# Altium project GSM_Link_12.PrjPcb
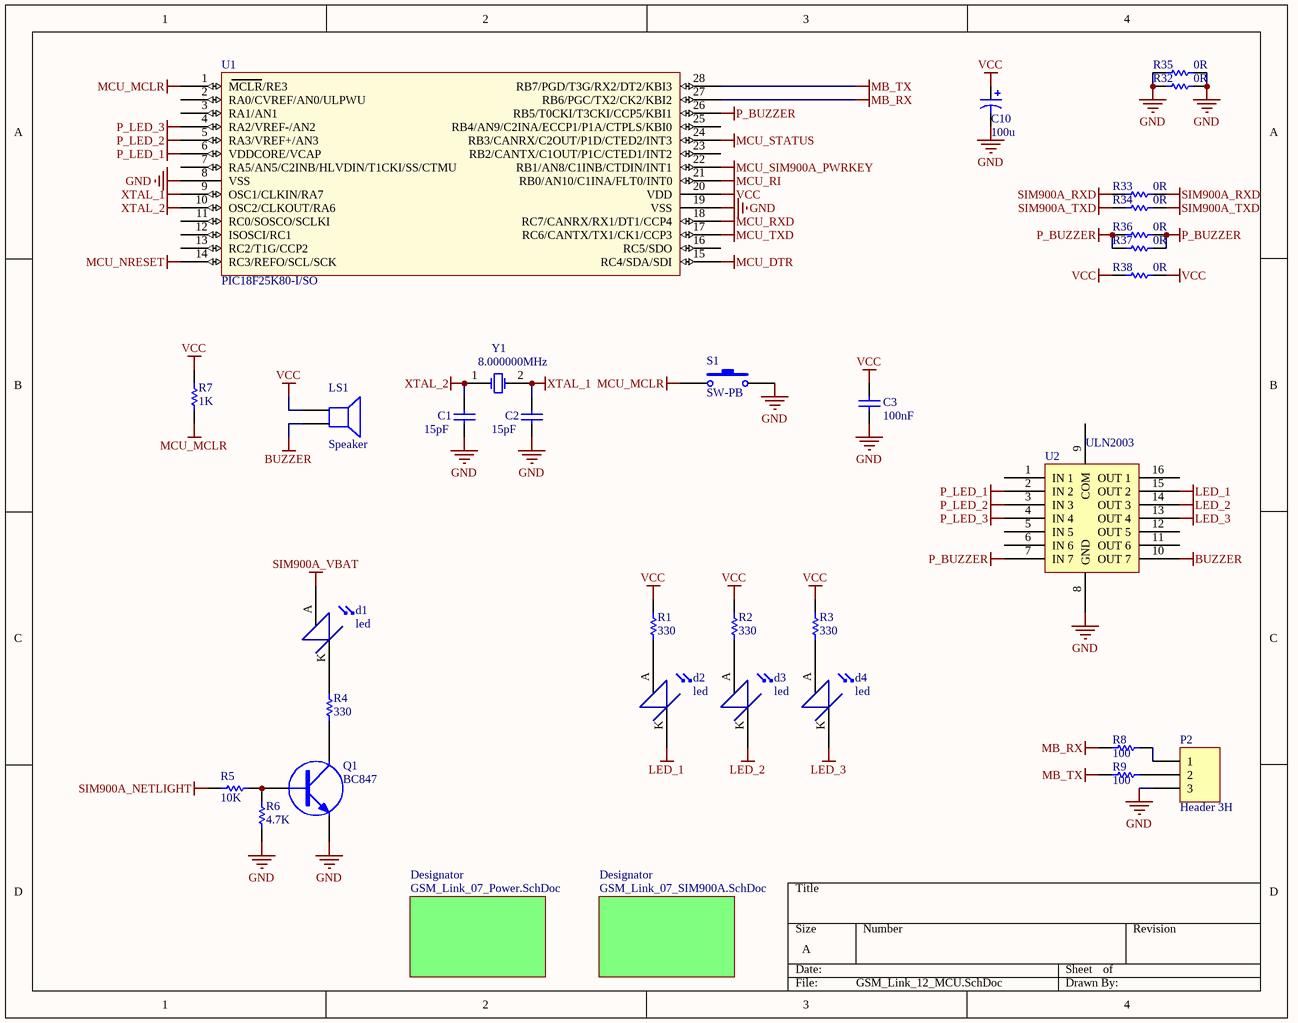
[diagram p0: GSM_Link_12_MCU.SchDoc]
3 sheets, 85 parts. Net scope: global (net labels, ports and power ports of the same name join across sheets).
Board file: GSM_Link_12.PcbDoc
Sheets:
  GSM_Link_12_MCU.SchDoc
  GSM_Link_12_Power.SchDoc
  GSM_Link_12_SIM900A.SchDoc

## Sheet GSM_Link_12_MCU.SchDoc
size A

### Parts
C1  15pF  [0805_smd]
C2  15pF  [0805_smd]
C3  100nF  [0805_smd]
C10  100u  [RB.1/.2_P]
d1  led  [0603_LED_SMD]
d2  led  [0603_LED_SMD]
d3  led  [0603_LED_SMD]
d4  led  [0603_LED_SMD]
LS1  Speaker  [BZ_KD]
P2  Header 3H  [CON3_XH]
Q1  BC847  [SOT23_SMD]
R1  330  [0805_SMD]
R2  330  [0805_SMD]
R3  330  [0805_SMD]
R4  330  [0805_SMD]
R5  10K  [0805_SMD]
R6  4.7K  [0805_SMD]
R7  1K  [1206_SMD]
R8  100  [0805_SMD]
R9  100  [0805_SMD]
R32  0R  [1206_SMD]
R33  0R  [1206_SMD]
R34  0R  [1206_SMD]
R35  0R  [1206_SMD]
R36  0R  [1206_SMD]
R37  0R  [2010_SMD]
R38  0R  [1206_SMD]
S1  SW-PB  [switch3_smd]
U1  PIC18F25K80-I/SO  [SOIC28_SMD]
U2  ULN2003  [SO-16_smd]
Y1  8.000000MHz  [rad-0.2]

### Sub-sheets
Designator = GSM_Link_07_SIM900A.SchDoc (file not in this document): no entries
Designator = GSM_Link_07_Power.SchDoc (file not in this document): no entries

### Nets
BUZZER: LS1.2 U2.10(OUT_7)
GND: C1.1 C2.1 C3.1 C10.2 P2.3 Q1.2(E) R6.1 R32.1 R32.2 R35.1 R35.2 S1.2 U1.8(VSS) U1.19(VSS) U2.8(GND)
LED_1: d2.K U2.15(OUT_2)
LED_2: d3.K U2.14(OUT_3)
LED_3: d4.K U2.13(OUT_4)
MB_RX: R8.1 U1.27(RB6/PGC/TX2/CK2/KBI2)
MB_TX: R9.1 U1.28(RB7/PGD/T3G/RX2/DT2/KBI3)
MCU_DTR: U1.15(RC4/SDA/SDI)
MCU_MCLR: R7.2 S1.1 U1.1(MCLR/RE3)
MCU_NRESET: U1.14(RC3/REFO/SCL/SCK)
MCU_RI: U1.21(RB0/AN10/C1INA/FLT0/INT0)
MCU_RXD: U1.18(RC7/CANRX/RX1/DT1/CCP4)
MCU_SIM900A_PWRKEY: U1.22(RB1/AN8/C1INB/CTDIN/INT1)
MCU_STATUS: U1.24(RB3/CANRX/C2OUT/P1D/CTED2/INT3)
MCU_TXD: U1.17(RC6/CANTX/TX1/CK1/CCP3)
P_BUZZER: R36.1 R36.2 R37.1 R37.2 U1.26(RB5/T0CKI/T3CKI/CCP5/KBI1) U2.7(IN_7)
P_LED_1: U1.6(VDDCORE/VCAP) U2.2(IN_2)
P_LED_2: U1.5(RA3/VREF+/AN3) U2.3(IN_3)
P_LED_3: U1.4(RA2/VREF-/AN2) U2.4(IN_4)
SIM900A_NETLIGHT: R5.2
SIM900A_RXD: R33.1 R33.2
SIM900A_TXD: R34.1 R34.2
SIM900A_VBAT: d1.A
VCC: C3.2 C10.1 LS1.1 R1.1 R2.1 R3.1 R7.1 R38.1 R38.2 U1.20(VDD)  [project net MCU_VCC]
XTAL_1: C2.2 U1.9(OSC1/CLKIN/RA7) Y1.2(OSC2)
XTAL_2: C1.2 U1.10(OSC2/CLKOUT/RA6) Y1.1(OSC1)
Netd1_K: d1.K R4.1
Netd2_A: d2.A R1.2
Netd3_A: d3.A R2.2
Netd4_A: d4.A R3.2
NetP2_1: P2.1 R8.2
NetP2_2: P2.2 R9.2
NetQ1_1: Q1.1(B) R5.1 R6.2
NetQ1_3: Q1.3(C) R4.2

Not connected (* = marked no-connect by the designer): U1 2(RA0/CVREF/AN0/ULPWU) 3(RA1/AN1) 7(RA5/AN5/C2INB/HLVDIN/T1CKI/SS/CTMU) 11(RC0/SOSCO/SCLKI) 12(ISOSCI/RC1) 13(RC2/T1G/CCP2) 16(RC5/SDO) 23(RB2/CANTX/C1OUT/P1C/CTED1/INT2) 25(RB4/AN9/C2INA/ECCP1/P1A/CTPLS/KBI0); U2 1(IN_1) 5(IN_5) 6(IN_6) 9(COM) 11(OUT_6) 12(OUT_5) 16(OUT_1)

### Library data of the parts
C1-C3 = Cap: Capacitor; Value: 100pF; Published: 8-Jun-2000; LatestRevisionDate: 17-Jul-2002; LatestRevisionNote: Re-released for DXP Platform.; PackageReference: RAD-0.3; Publisher: Altium Limited
C10 = Cap Pol1: Polarized Capacitor (Radial); Value: 100nF; Published: 8-Jun-2000; LatestRevisionDate: 17-Jul-2002; LatestRevisionNote: Re-released for DXP Platform.; PackageReference: RB7.6-15; Publisher: Altium Limited
LS1 = Speaker: Loudspeaker; Published: 24-Mar-1999; LatestRevisionDate: 17-Jul-2002; LatestRevisionNote: Re-released for DXP Platform.; PackageReference: PIN2; Publisher: Altium Limited
P2 = Header 3H: Header, 3-Pin, Right Angle; LatestRevisionDate: 17-Jul-2002; LatestRevisionNote: Re-released for DXP Platform.; Publisher: Altium Limited
Q1 = BC547
R1-R9 = Res1: Resistor; Published: 8-Jun-2000; LatestRevisionDate: 17-Jul-2002; LatestRevisionNote: Re-released for DXP Platform.; PackageReference: AXIAL-0.3; Publisher: Altium Limited
  R1-R4: Value: 330
  R5: Value: 10k
  R6: Value: 4.7k
  R7: Value: 1K
  R8 R9: Value: 100
R32-R38 = Res1: Resistor; Value: 0; Published: 8-Jun-2000; LatestRevisionDate: 17-Jul-2002; LatestRevisionNote: Re-released for DXP Platform.; PackageReference: AXIAL-0.3; Publisher: Altium Limited
S1 = SW-PB: Switch; Published: 24-Mar-1999; LatestRevisionDate: 17-Jul-2002; LatestRevisionNote: Re-released for DXP Platform.; PackageReference: SPST-2; Publisher: Altium Limited
Y1 = XTAL: Crystal Oscillator; Published: 8-Jun-2000; LatestRevisionDate: 17-Jul-2002; LatestRevisionNote: Re-released for DXP Platform.; PackageReference: R38; Publisher: Altium Limited

## Sheet GSM_Link_12_Power.SchDoc
size A
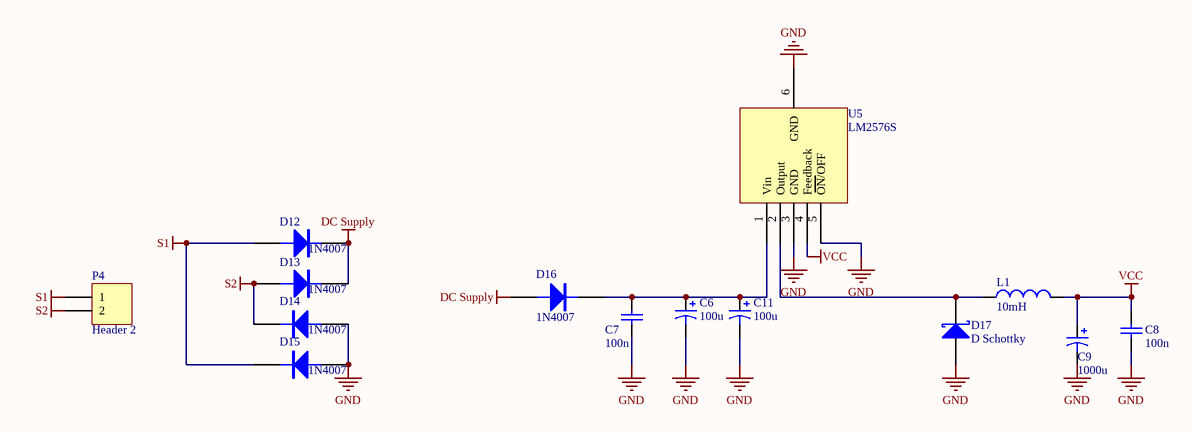
[diagram p1: GSM_Link_12_Power.SchDoc]

### Parts
C6  100u  [RB.2/.4_p]
C7  100n  [0805_smd]
C8  100n  [0805_smd]
C9  1000u  [RB.2/.4_p]
C11  100u  [RB.1/.2_P]
D12  1N4007  [7227_SMD]
D13  1N4007  [7227_SMD]
D14  1N4007  [7227_SMD]
D15  1N4007  [7227_SMD]
D16  1N4007  [7227_SMD]
D17  D Schottky  [7227_SMD]
L1  10mH  [RB.2/.4]
P4  Header 2  [PCON_2]
U5  LM2576S  [D2PAK_SMD]

### Nets
DC Supply: D12.K D13.K D16.A
GND: C6.2 C7.1 C8.1 C9.2 C11.2 D14.A D15.A D17.A U5.3(GND) U5.5(ON/OFF) U5.6(GND)
S1: D12.A D15.K P4.1
S2: D13.A D14.K P4.2
VCC: C8.2 C9.1 L1.2 U5.4(Feedback)  [project net MCU_VCC]
NetC6_1: C6.1 C7.2 C11.1 D16.K U5.1(Vin)
NetD17_K: D17.K L1.1 U5.2(Output)

### Library data of the parts
C6 C9 C11 = Cap Pol1: as C10 on sheet GSM_Link_12_MCU; Published: 8-Jun-2000; LatestRevisionDate: 17-Jul-2002; LatestRevisionNote: Re-released for DXP Platform.; PackageReference: RB7.6-15; Publisher: Altium Limited
C7 C8 = Cap: Capacitor; Value: 100u; Published: 8-Jun-2000; LatestRevisionDate: 17-Jul-2002; LatestRevisionNote: Re-released for DXP Platform.; PackageReference: RAD-0.3; Publisher: Altium Limited
D12-D16 = DIODE
D17 = D Schottky: Schottky Diode; Published: 8-Jun-2000; LatestRevisionDate: 17-Jul-2002; LatestRevisionNote: Re-released for DXP Platform.; PackageReference: SMB; Publisher: Altium Limited; Code_JEDEC: DO-214-AA
L1 = Inductor: Code_IEC: 1005; Published: 8-Jun-2000; LatestRevisionDate: 17-Jul-2002; LatestRevisionNote: Re-released for DXP Platform.; PackageReference: 0402-A; Publisher: Altium Limited; Code_JEITA: 0402; Value: 10mH
P4 = Header 2: Header, 2-Pin; LatestRevisionDate: 17-Jul-2002; LatestRevisionNote: Re-released for DXP Platform.; Publisher: Altium Limited

## Sheet GSM_Link_12_SIM900A.SchDoc
size A
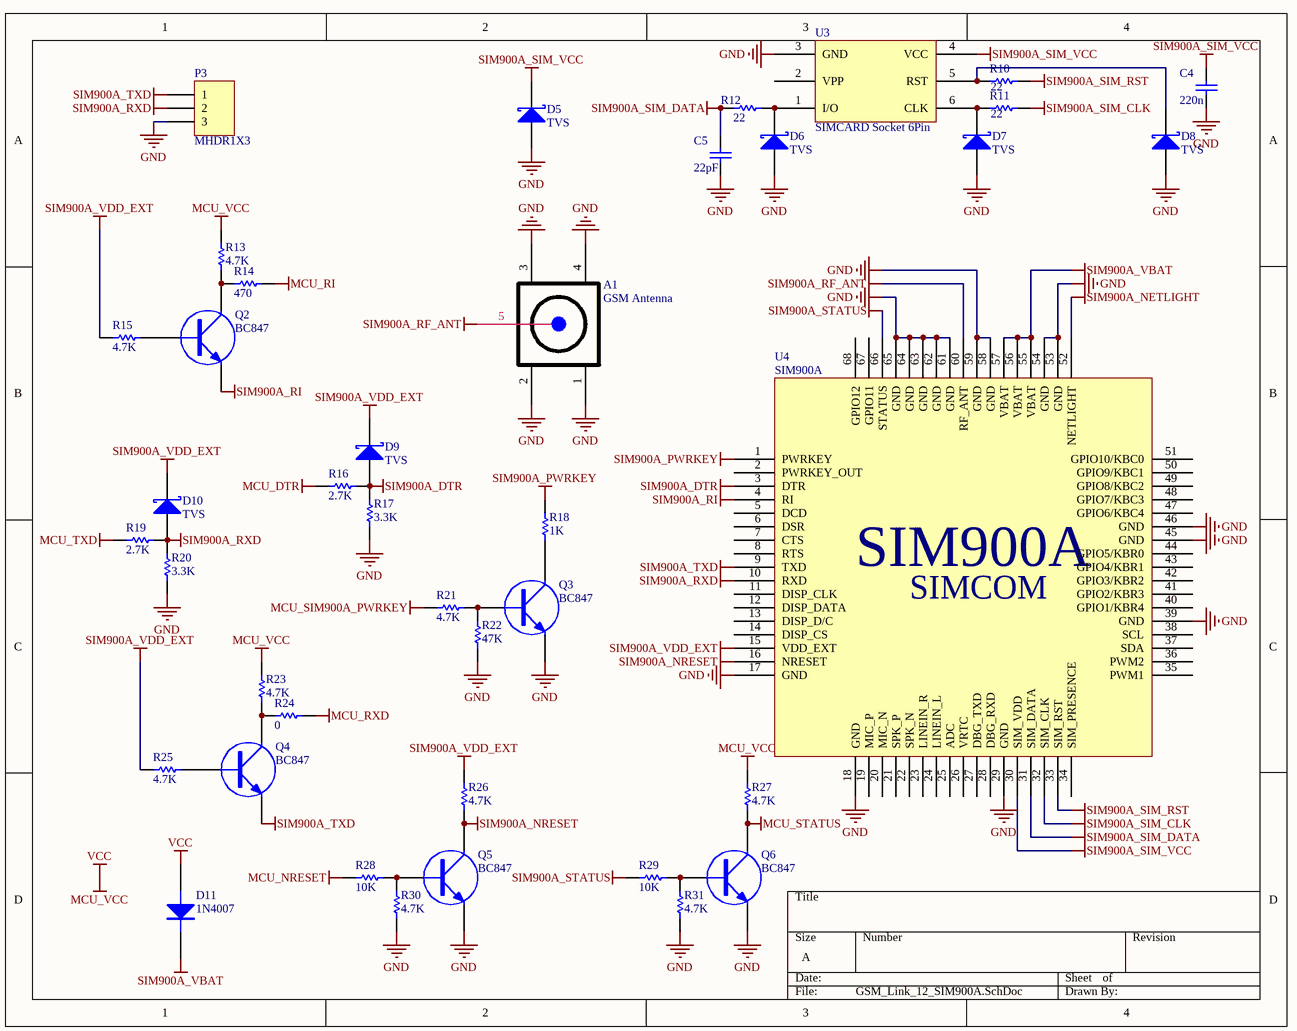
[diagram p2: GSM_Link_12_SIM900A.SchDoc]

### Parts
A1  GSM Antenna  [SMA Right Female]
C4  220n  [0805_smd]
C5  22pF  [0805_smd]
D5  TVS  [7227_SMD]
D6  TVS  [7227_SMD]
D7  TVS  [7227_SMD]
D8  TVS  [7227_SMD]
D9  TVS  [7227_SMD]
D10  TVS  [7227_SMD]
D11  1N4007  [7227_SMD]
P3  MHDR1X3  [CON3_XH]
Q2  BC847  [SOT23_SMD]
Q3  BC847  [SOT23_SMD]
Q4  BC847  [SOT23_SMD]
Q5  BC847  [SOT23_SMD]
Q6  BC847  [SOT23_SMD]
R10  22  [0805_SMD]
R11  22  [0805_SMD]
R12  22  [1206_SMD]
R13  4.7K  [0805_SMD]
R14  470  [1206_SMD]
R15  4.7K  [0805_SMD]
R16  2.7K  [1206_SMD]
R17  3.3K  [0805_SMD]
R18  1K  [0805_SMD]
R19  2.7K  [1206_SMD]
R20  3.3K  [1206_SMD]
R21  4.7K  [0805_SMD]
R22  47K  [0805_SMD]
R23  4.7K  [1206_SMD]
R24  0  [1206_SMD]
R25  4.7K  [0805_SMD]
R26  4.7K  [0805_SMD]
R27  4.7K  [0805_SMD]
R28  10K  [1206_SMD]
R29  10K  [0805_SMD]
R30  4.7K  [0805_SMD]
R31  4.7K  [0805_SMD]
U3  SIMCARD Socket 6Pin  [SIMCARD Socket - Ejector]
U4  SIM900A  [SIM900A]

### Nets
GND: A1.1 A1.2 A1.3 A1.4 C4.1 C5.1 D5.A D6.A D7.A D8.A P3.3 Q3.2(E) Q5.2(E) Q6.2(E) R17.1 R20.1 R22.2 R30.1 R31.1 U3.3(GND) U4.17(GND) U4.18(GND) U4.29(GND) U4.39(GND) U4.45(GND) U4.46(GND) U4.53(GND) U4.54(GND) U4.58(GND) U4.59(GND) U4.61(GND) U4.62(GND) U4.63(GND) U4.64(GND) U4.65(GND)
MCU_DTR: R16.2
MCU_NRESET: R28.1
MCU_RI: R14.2
MCU_RXD: R24.2
MCU_SIM900A_PWRKEY: R21.1
MCU_STATUS: Q6.3(C) R27.2
MCU_TXD: R19.2
MCU_VCC: D11.A R13.2 R23.2 R27.1  [also labelled VCC]
SIM900A_DTR: D9.A R16.1 R17.2 U4.3(DTR)
SIM900A_NETLIGHT: U4.52(NETLIGHT)
SIM900A_NRESET: Q5.3(C) R26.1 U4.16(NRESET)
SIM900A_PWRKEY: R18.2 U4.1(PWRKEY)
SIM900A_RF_ANT: A1.5 U4.60(RF_ANT)
SIM900A_RI: Q2.2(E) U4.4(RI)
SIM900A_RXD: D10.A P3.2 R19.1 R20.2 U4.10(RXD)
SIM900A_SIM_CLK: R11.2 U4.32(SIM_CLK)
SIM900A_SIM_DATA: C5.2 R12.2 U4.31(SIM_DATA)
SIM900A_SIM_RST: R10.2 U4.33(SIM_RST)
SIM900A_SIM_VCC: C4.2 D5.K U3.4(VCC) U4.30(SIM_VDD)
SIM900A_STATUS: R29.2 U4.66(STATUS)
SIM900A_TXD: P3.1 Q4.2(E) U4.9(TXD)
SIM900A_VBAT: D11.K U4.55(VBAT) U4.56(VBAT) U4.57(VBAT)
SIM900A_VDD_EXT: D9.K D10.K R15.1 R25.1 R26.2 U4.15(VDD_EXT)
NetD6_K: D6.K R12.1 U3.1(I/O)
NetD7_K: D7.K R11.1 U3.6(CLK)
NetD8_K: D8.K R10.1 U3.5(RST)
NetQ2_1: Q2.1(B) R15.2
NetQ2_3: Q2.3(C) R13.1 R14.1
NetQ3_1: Q3.1(B) R21.2 R22.1
NetQ3_3: Q3.3(C) R18.1
NetQ4_1: Q4.1(B) R25.2
NetQ4_3: Q4.3(C) R23.1 R24.1
NetQ5_1: Q5.1(B) R28.2 R30.2
NetQ6_1: Q6.1(B) R29.1 R31.2

Not connected (* = marked no-connect by the designer): U3 2(VPP); U4 2(PWRKEY_OUT) 5(DCD) 6(DSR) 7(CTS) 8(RTS) 11(DISP_CLK) 12(DISP_DATA) 13(DISP_D/C) 14(DISP_CS) 19(MIC_P) 20(MIC_N) 21(SPK_P) 22(SPK_N) 23(LINEIN_R) 24(LINEIN_L) 25(ADC) 26(VRTC) 27(DBG_TXD) 28(DBG_RXD) 34(SIM_PRESENCE) 35(PWM1) 36(PWM2) 37(SDA) 38(SCL) 40(GPIO1/KBR4) 41(GPIO2/KBR3) 42(GPIO3/KBR2) 43(GPIO4/KBR1) 44(GPIO5/KBR0) 47(GPIO6/KBC4) 48(GPIO7/KBC3) 49(GPIO8/KBC2) 50(GPIO9/KBC1) 51(GPIO10/KBC0) 67(GPIO11) 68(GPIO12)

### Notes on the sheet
- (in symbol SIM900A) SIMCOM

### Library data of the parts
A1 = SMA KWE-F
C4 C5 = Cap: Capacitor; Value: 100u; Published: 8-Jun-2000; LatestRevisionDate: 17-Jul-2002; LatestRevisionNote: Re-released for DXP Platform.; PackageReference: RAD-0.3; Publisher: Altium Limited
D5-D10 = D Schottky: Schottky Diode; Published: 8-Jun-2000; LatestRevisionDate: 17-Jul-2002; LatestRevisionNote: Re-released for DXP Platform.; PackageReference: SMB; Publisher: Altium Limited; Code_JEDEC: DO-214-AA
D11 = DIODE
P3 = MHDR1X3: Header, 3-Pin; LatestRevisionDate: 17-Jul-2002; LatestRevisionNote: Re-released for DXP Platform.; Publisher: Altium Limited
Q2-Q6 = BC547
R10-R23 R25-R31 = Res1: Resistor; Published: 8-Jun-2000; LatestRevisionDate: 17-Jul-2002; LatestRevisionNote: Re-released for DXP Platform.; PackageReference: AXIAL-0.3; Publisher: Altium Limited
  R10-R12: Value: 22
  R13 R15 R21 R23 R25-R27 R30 R31: Value: 4.7K
  R14: Value: 470
  R16 R19: Value: 2.7K
  R17 R20: Value: 3.3K
  R18: Value: 1K
  R22: Value: 47K
  R28 R29: Value: 10K
R24 = Res1: Resistor; Value: 0R; Published: 8-Jun-2000; LatestRevisionDate: 17-Jul-2002; LatestRevisionNote: Re-released for DXP Platform.; PackageReference: AXIAL-0.3; Publisher: Altium Limited
U3 = SIM_SOCKET_6PIN

## Nets that join several sheets
GND: GSM_Link_12_MCU (15 pins), GSM_Link_12_Power (11 pins), GSM_Link_12_SIM900A (35 pins)
MCU_DTR: GSM_Link_12_MCU (U1.15), GSM_Link_12_SIM900A (R16.2)
MCU_NRESET: GSM_Link_12_MCU (U1.14), GSM_Link_12_SIM900A (R28.1)
MCU_RI: GSM_Link_12_MCU (U1.21), GSM_Link_12_SIM900A (R14.2)
MCU_RXD: GSM_Link_12_MCU (U1.18), GSM_Link_12_SIM900A (R24.2)
MCU_SIM900A_PWRKEY: GSM_Link_12_MCU (U1.22), GSM_Link_12_SIM900A (R21.1)
MCU_STATUS: GSM_Link_12_MCU (U1.24), GSM_Link_12_SIM900A (Q6.3 R27.2)
MCU_TXD: GSM_Link_12_MCU (U1.17), GSM_Link_12_SIM900A (R19.2)
MCU_VCC: GSM_Link_12_MCU (10 pins), GSM_Link_12_Power (C8.2 C9.1 L1.2 U5.4), GSM_Link_12_SIM900A (D11.A R13.2 R23.2 R27.1)
SIM900A_NETLIGHT: GSM_Link_12_MCU (R5.2), GSM_Link_12_SIM900A (U4.52)
SIM900A_RXD: GSM_Link_12_MCU (R33.1 R33.2), GSM_Link_12_SIM900A (5 pins)
SIM900A_TXD: GSM_Link_12_MCU (R34.1 R34.2), GSM_Link_12_SIM900A (P3.1 Q4.2 U4.9)
SIM900A_VBAT: GSM_Link_12_MCU (d1.A), GSM_Link_12_SIM900A (D11.K U4.55 U4.56 U4.57)